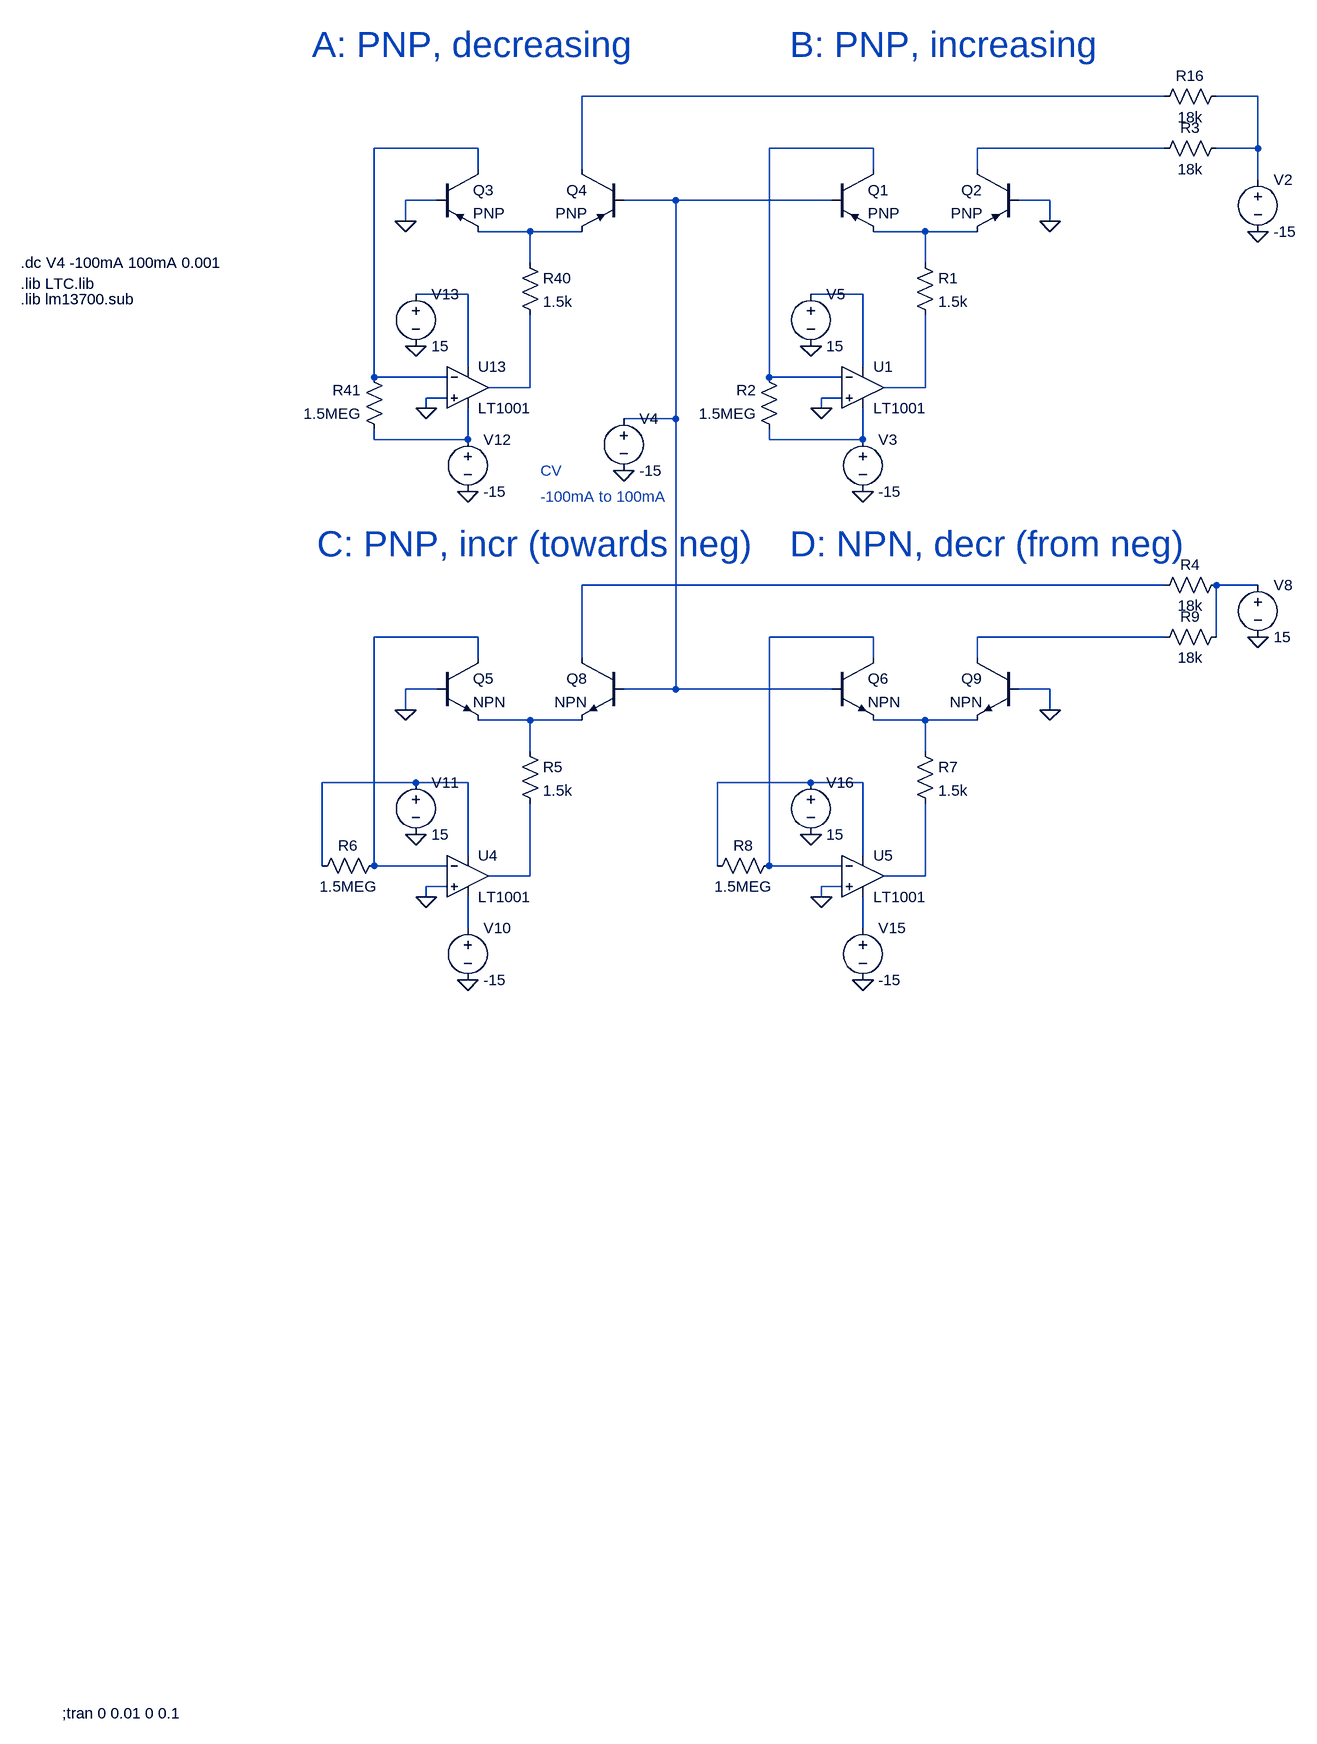
[diagram p0: schematic expo_converter_test--debug.asc]
expo_converter_test--debug.asc, the LTspice schematic file:
Version 4
SHEET 1 3748 1108
WIRE 912 -1472 16 -1472
WIRE 1056 -1472 992 -1472
WIRE -144 -1392 -304 -1392
WIRE 464 -1392 304 -1392
WIRE 912 -1392 624 -1392
WIRE 1056 -1392 1056 -1472
WIRE 1056 -1392 992 -1392
WIRE -144 -1360 -144 -1392
WIRE 16 -1360 16 -1472
WIRE 464 -1360 464 -1392
WIRE 624 -1360 624 -1392
WIRE 1056 -1344 1056 -1392
WIRE -208 -1312 -256 -1312
WIRE 160 -1312 80 -1312
WIRE 400 -1312 160 -1312
WIRE 736 -1312 688 -1312
WIRE -256 -1280 -256 -1312
WIRE 736 -1280 736 -1312
WIRE -64 -1264 -144 -1264
WIRE 16 -1264 -64 -1264
WIRE 544 -1264 464 -1264
WIRE 624 -1264 544 -1264
WIRE -64 -1216 -64 -1264
WIRE 544 -1216 544 -1264
WIRE -160 -1168 -240 -1168
WIRE 448 -1168 368 -1168
WIRE -160 -1056 -160 -1168
WIRE 448 -1056 448 -1168
WIRE -304 -1040 -304 -1392
WIRE -192 -1040 -304 -1040
WIRE 304 -1040 304 -1392
WIRE 416 -1040 304 -1040
WIRE -64 -1024 -64 -1136
WIRE -64 -1024 -128 -1024
WIRE 544 -1024 544 -1136
WIRE 544 -1024 480 -1024
WIRE -192 -1008 -224 -1008
WIRE 416 -1008 384 -1008
WIRE -224 -992 -224 -1008
WIRE 384 -992 384 -1008
WIRE 160 -976 160 -1312
WIRE 160 -976 80 -976
WIRE -304 -944 -304 -960
WIRE -160 -944 -160 -992
WIRE -160 -944 -304 -944
WIRE 304 -944 304 -960
WIRE 448 -944 448 -992
WIRE 448 -944 304 -944
WIRE 912 -720 16 -720
WIRE 1056 -720 992 -720
WIRE -144 -640 -304 -640
WIRE 464 -640 304 -640
WIRE 912 -640 624 -640
WIRE 992 -640 992 -720
WIRE -144 -608 -144 -640
WIRE 16 -608 16 -720
WIRE 464 -608 464 -640
WIRE 624 -608 624 -640
WIRE -208 -560 -256 -560
WIRE 160 -560 160 -976
WIRE 160 -560 80 -560
WIRE 400 -560 160 -560
WIRE 736 -560 688 -560
WIRE -256 -528 -256 -560
WIRE 736 -528 736 -560
WIRE -64 -512 -144 -512
WIRE 16 -512 -64 -512
WIRE 544 -512 464 -512
WIRE 624 -512 544 -512
WIRE -64 -464 -64 -512
WIRE 544 -464 544 -512
WIRE -240 -416 -384 -416
WIRE -160 -416 -240 -416
WIRE 368 -416 224 -416
WIRE 448 -416 368 -416
WIRE -160 -304 -160 -416
WIRE 448 -304 448 -416
WIRE -384 -288 -384 -416
WIRE -304 -288 -304 -640
WIRE -192 -288 -304 -288
WIRE 224 -288 224 -416
WIRE 304 -288 304 -640
WIRE 416 -288 304 -288
WIRE -64 -272 -64 -384
WIRE -64 -272 -128 -272
WIRE 544 -272 544 -384
WIRE 544 -272 480 -272
WIRE -192 -256 -224 -256
WIRE 416 -256 384 -256
WIRE -224 -240 -224 -256
WIRE 384 -240 384 -256
WIRE -160 -192 -160 -240
WIRE 448 -192 448 -240
FLAG 1056 -1264 0
FLAG -160 -864 0
FLAG -240 -1088 0
FLAG -224 -992 0
FLAG -256 -1280 0
FLAG 80 -896 0
FLAG 448 -864 0
FLAG 368 -1088 0
FLAG 384 -992 0
FLAG 736 -1280 0
FLAG 1056 -640 0
FLAG -160 -112 0
FLAG -240 -336 0
FLAG -224 -240 0
FLAG -256 -528 0
FLAG 448 -112 0
FLAG 368 -336 0
FLAG 384 -240 0
FLAG 736 -528 0
SYMBOL res 896 -1456 R270
WINDOW 0 32 56 VTop 2
WINDOW 3 0 56 VBottom 2
SYMATTR InstName R16
SYMATTR Value 18k
SYMBOL voltage 1056 -1360 R0
WINDOW 123 0 0 Left 2
WINDOW 39 0 0 Left 2
SYMATTR InstName V2
SYMATTR Value -15
SYMBOL voltage -160 -960 R0
WINDOW 123 0 0 Left 2
WINDOW 39 0 0 Left 2
SYMATTR InstName V12
SYMATTR Value -15
SYMBOL voltage -240 -1184 R0
WINDOW 123 0 0 Left 2
WINDOW 39 0 0 Left 2
SYMATTR InstName V13
SYMATTR Value 15
SYMBOL pnp -208 -1360 R0
SYMATTR InstName Q3
SYMBOL pnp 80 -1360 M0
SYMATTR InstName Q4
SYMBOL Opamps\\LT1001 -160 -1088 R0
SYMATTR InstName U13
SYMBOL res -80 -1232 R0
SYMATTR InstName R40
SYMATTR Value 1.5k
SYMBOL res -288 -944 R180
WINDOW 0 36 76 Left 2
WINDOW 3 36 40 Left 2
SYMATTR InstName R41
SYMATTR Value 1.5MEG
SYMBOL voltage 80 -992 R0
WINDOW 123 0 0 Left 2
WINDOW 39 0 0 Left 2
SYMATTR InstName V4
SYMATTR Value -15
SYMBOL voltage 448 -960 R0
WINDOW 123 0 0 Left 2
WINDOW 39 0 0 Left 2
SYMATTR InstName V3
SYMATTR Value -15
SYMBOL voltage 368 -1184 R0
WINDOW 123 0 0 Left 2
WINDOW 39 0 0 Left 2
SYMATTR InstName V5
SYMATTR Value 15
SYMBOL pnp 400 -1360 R0
SYMATTR InstName Q1
SYMBOL pnp 688 -1360 M0
SYMATTR InstName Q2
SYMBOL Opamps\\LT1001 448 -1088 R0
SYMATTR InstName U1
SYMBOL res 528 -1232 R0
SYMATTR InstName R1
SYMATTR Value 1.5k
SYMBOL res 320 -944 R180
WINDOW 0 36 76 Left 2
WINDOW 3 36 40 Left 2
SYMATTR InstName R2
SYMATTR Value 1.5MEG
SYMBOL res 896 -1376 R270
WINDOW 0 32 56 VTop 2
WINDOW 3 0 56 VBottom 2
SYMATTR InstName R3
SYMATTR Value 18k
SYMBOL res 896 -704 R270
WINDOW 0 32 56 VTop 2
WINDOW 3 0 56 VBottom 2
SYMATTR InstName R4
SYMATTR Value 18k
SYMBOL voltage 1056 -736 R0
WINDOW 123 0 0 Left 2
WINDOW 39 0 0 Left 2
SYMATTR InstName V8
SYMATTR Value 15
SYMBOL voltage -160 -208 R0
WINDOW 123 0 0 Left 2
WINDOW 39 0 0 Left 2
SYMATTR InstName V10
SYMATTR Value -15
SYMBOL voltage -240 -432 R0
WINDOW 123 0 0 Left 2
WINDOW 39 0 0 Left 2
SYMATTR InstName V11
SYMATTR Value 15
SYMBOL Opamps\\LT1001 -160 -336 R0
SYMATTR InstName U4
SYMBOL res -80 -480 R0
SYMATTR InstName R5
SYMATTR Value 1.5k
SYMBOL res -400 -272 R270
WINDOW 0 32 56 VTop 2
WINDOW 3 0 56 VBottom 2
SYMATTR InstName R6
SYMATTR Value 1.5MEG
SYMBOL voltage 448 -208 R0
WINDOW 123 0 0 Left 2
WINDOW 39 0 0 Left 2
SYMATTR InstName V15
SYMATTR Value -15
SYMBOL voltage 368 -432 R0
WINDOW 123 0 0 Left 2
WINDOW 39 0 0 Left 2
SYMATTR InstName V16
SYMATTR Value 15
SYMBOL Opamps\\LT1001 448 -336 R0
SYMATTR InstName U5
SYMBOL res 528 -480 R0
SYMATTR InstName R7
SYMATTR Value 1.5k
SYMBOL res 208 -272 R270
WINDOW 0 32 56 VTop 2
WINDOW 3 0 56 VBottom 2
SYMATTR InstName R8
SYMATTR Value 1.5MEG
SYMBOL res 896 -624 R270
WINDOW 0 32 56 VTop 2
WINDOW 3 0 56 VBottom 2
SYMATTR InstName R9
SYMATTR Value 18k
SYMBOL npn -208 -608 R0
SYMATTR InstName Q5
SYMBOL npn 400 -608 R0
SYMATTR InstName Q6
SYMBOL npn 80 -608 M0
SYMATTR InstName Q8
SYMBOL npn 688 -608 M0
SYMATTR InstName Q9
TEXT -784 1016 Left 2 !;tran 0 0.01 0 0.1
TEXT -848 -1216 Left 2 !.dc V4 -100mA 100mA 0.001
TEXT -848 -1184 Left 2 !.lib LTC.lib
TEXT -848 -1160 Left 2 !.lib lm13700.sub
TEXT -400 -1552 Left 5 ;A: PNP, decreasing
TEXT 336 -1552 Left 5 ;B: PNP, increasing
TEXT -392 -784 Left 5 ;C: PNP, incr (towards neg)
TEXT 336 -784 Left 5 ;D: NPN, decr (from neg)
TEXT -48 -896 Left 2 ;CV
TEXT -48 -856 Left 2 ;-100mA to 100mA

The netlist it stands for:
* expo_converter_test--debug.asc
R16 N001 N002 18k
V2 N002 0 -15
V12 N013 0 -15
V13 N009 0 15
Q3 N003 0 N007 0 PNP
Q4 N001 N006 N007 0 PNP
XU13 0 N003 N009 N013 N011 LT1001  ; pins In+ In- V+ V- OUT
R40 N007 N011 1.5k
R41 N013 N003 1.5MEG
V4 N006 0 -15
V3 N014 0 -15
V5 N010 0 15
Q1 N004 N006 N008 0 PNP
Q2 N005 0 N008 0 PNP
XU1 0 N004 N010 N014 N012 LT1001  ; pins In+ In- V+ V- OUT
R1 N008 N012 1.5k
R2 N014 N004 1.5MEG
R3 N005 N002 18k
R4 N015 N016 18k
V8 N016 0 15
V10 N026 0 -15
V11 N022 0 15
XU4 0 N017 N022 N026 N024 LT1001  ; pins In+ In- V+ V- OUT
R5 N020 N024 1.5k
R6 N022 N017 1.5MEG
V15 N027 0 -15
V16 N023 0 15
XU5 0 N018 N023 N027 N025 LT1001  ; pins In+ In- V+ V- OUT
R7 N021 N025 1.5k
R8 N023 N018 1.5MEG
R9 N019 N016 18k
Q5 N017 0 N020 0 NPN
Q6 N018 N006 N021 0 NPN
Q8 N015 N006 N020 0 NPN
Q9 N019 0 N021 0 NPN
.model NPN NPN
.model PNP PNP
.lib standard.bjt
;tran 0 0.01 0 0.1
.dc V4 -100mA 100mA 0.001
.lib LTC.lib
.lib lm13700.sub
* A: PNP, decreasing
* B: PNP, increasing
* C: PNP, incr (towards neg)
* D: NPN, decr (from neg)
* CV
* -100mA to 100mA
.lib LTC.lib
.backanno
.end